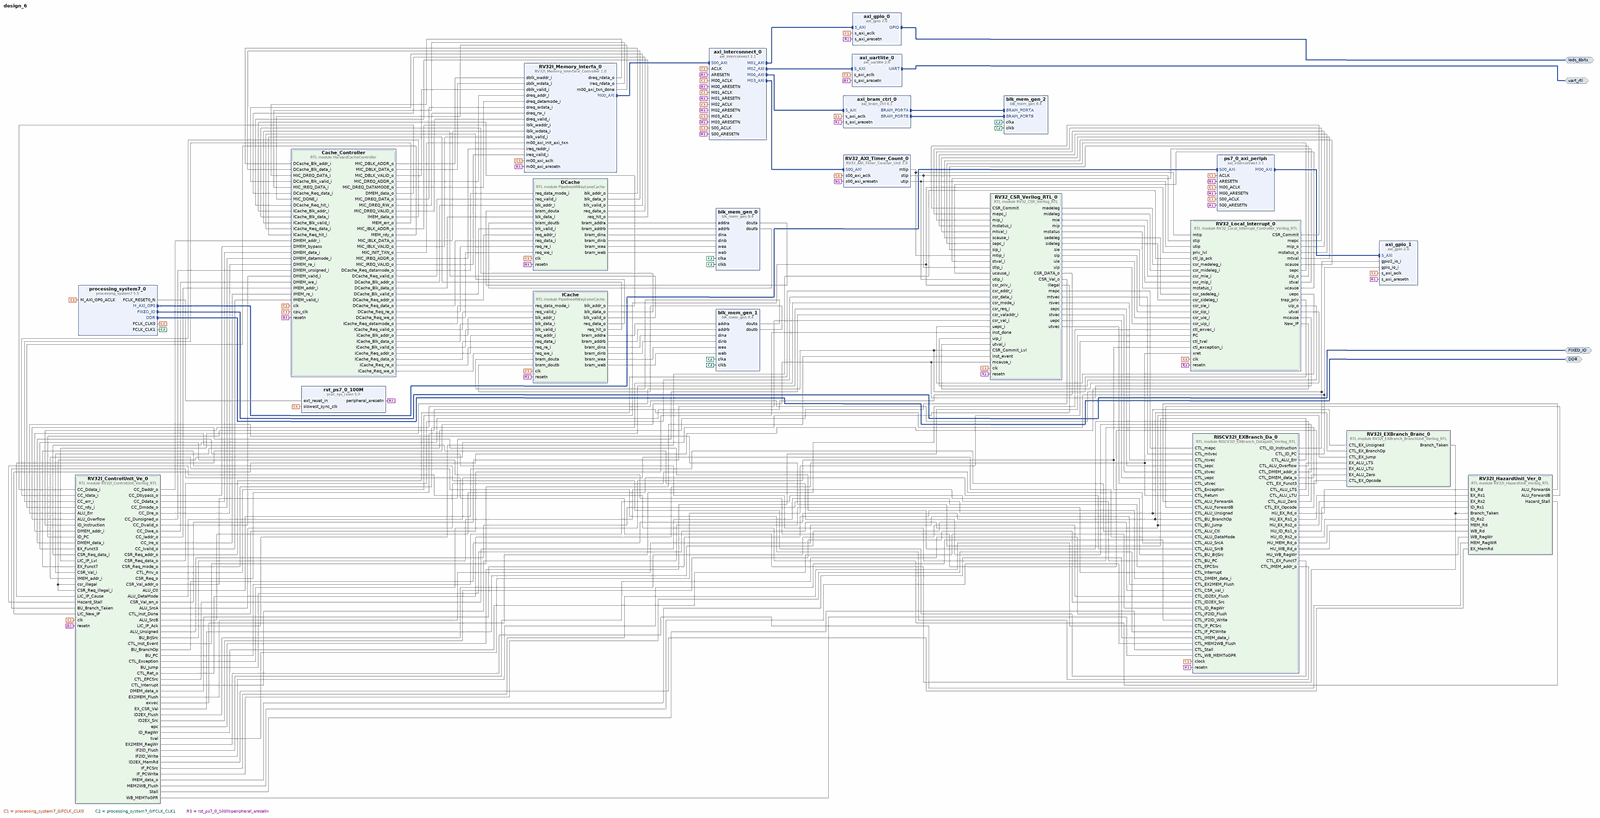
[diagram p0: block diagram of the top level, whole]
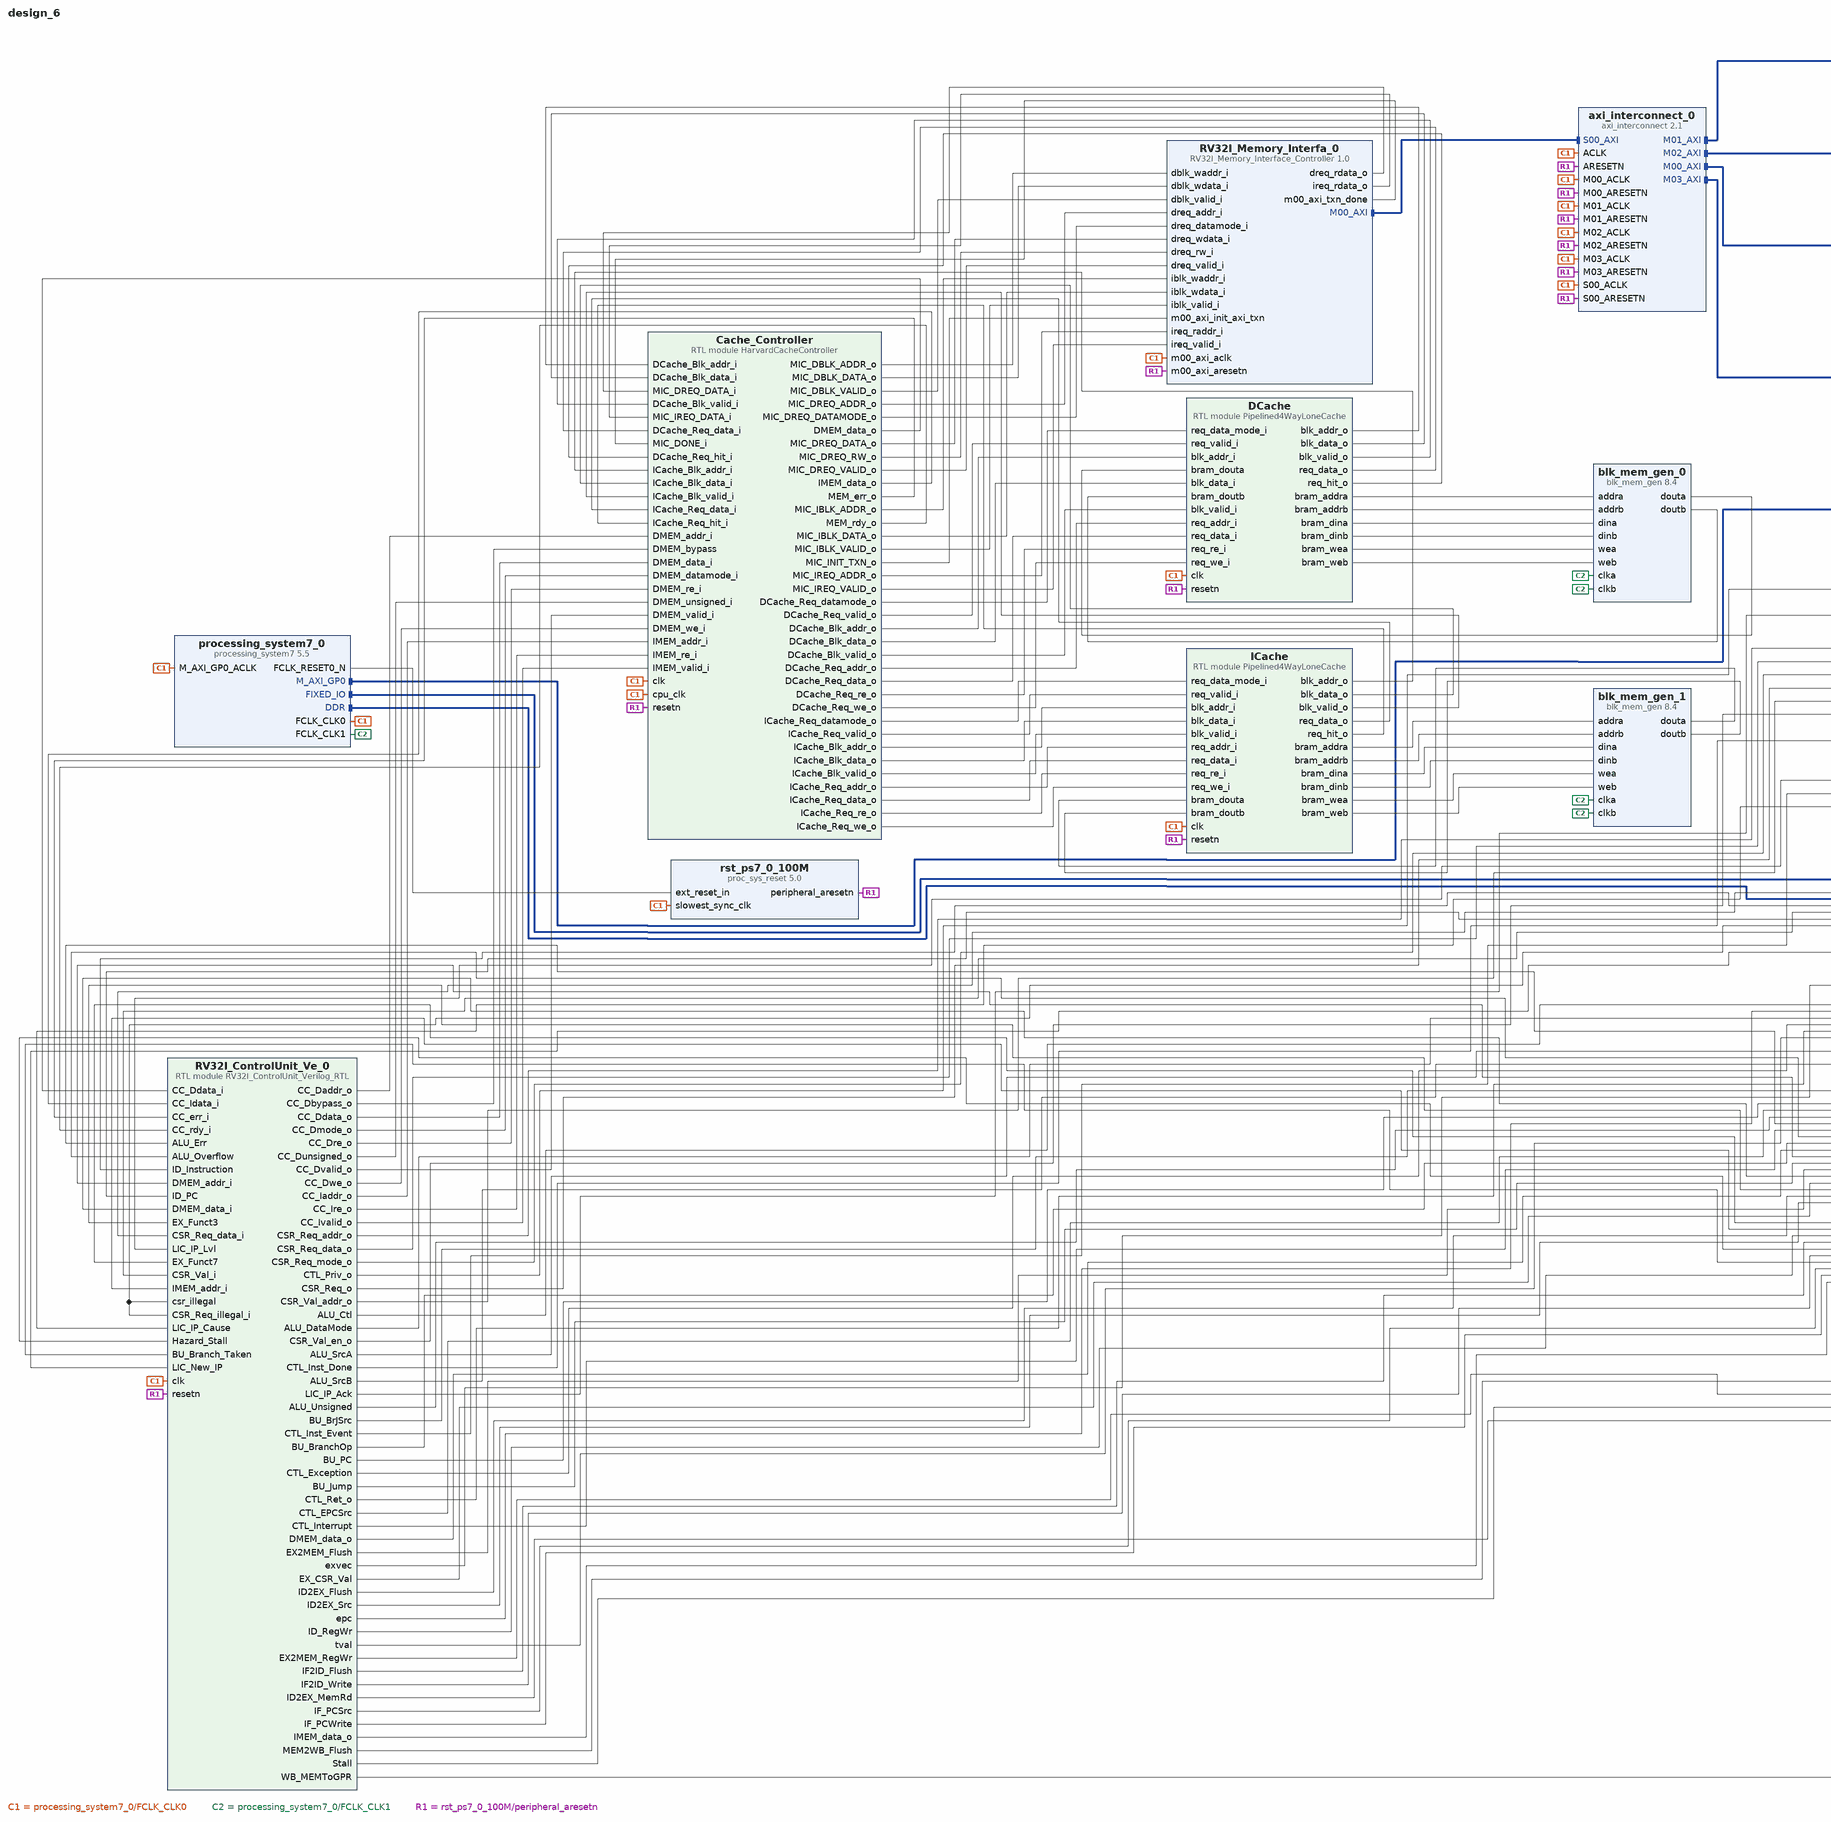
[diagram p1: block diagram of the top level, left part]
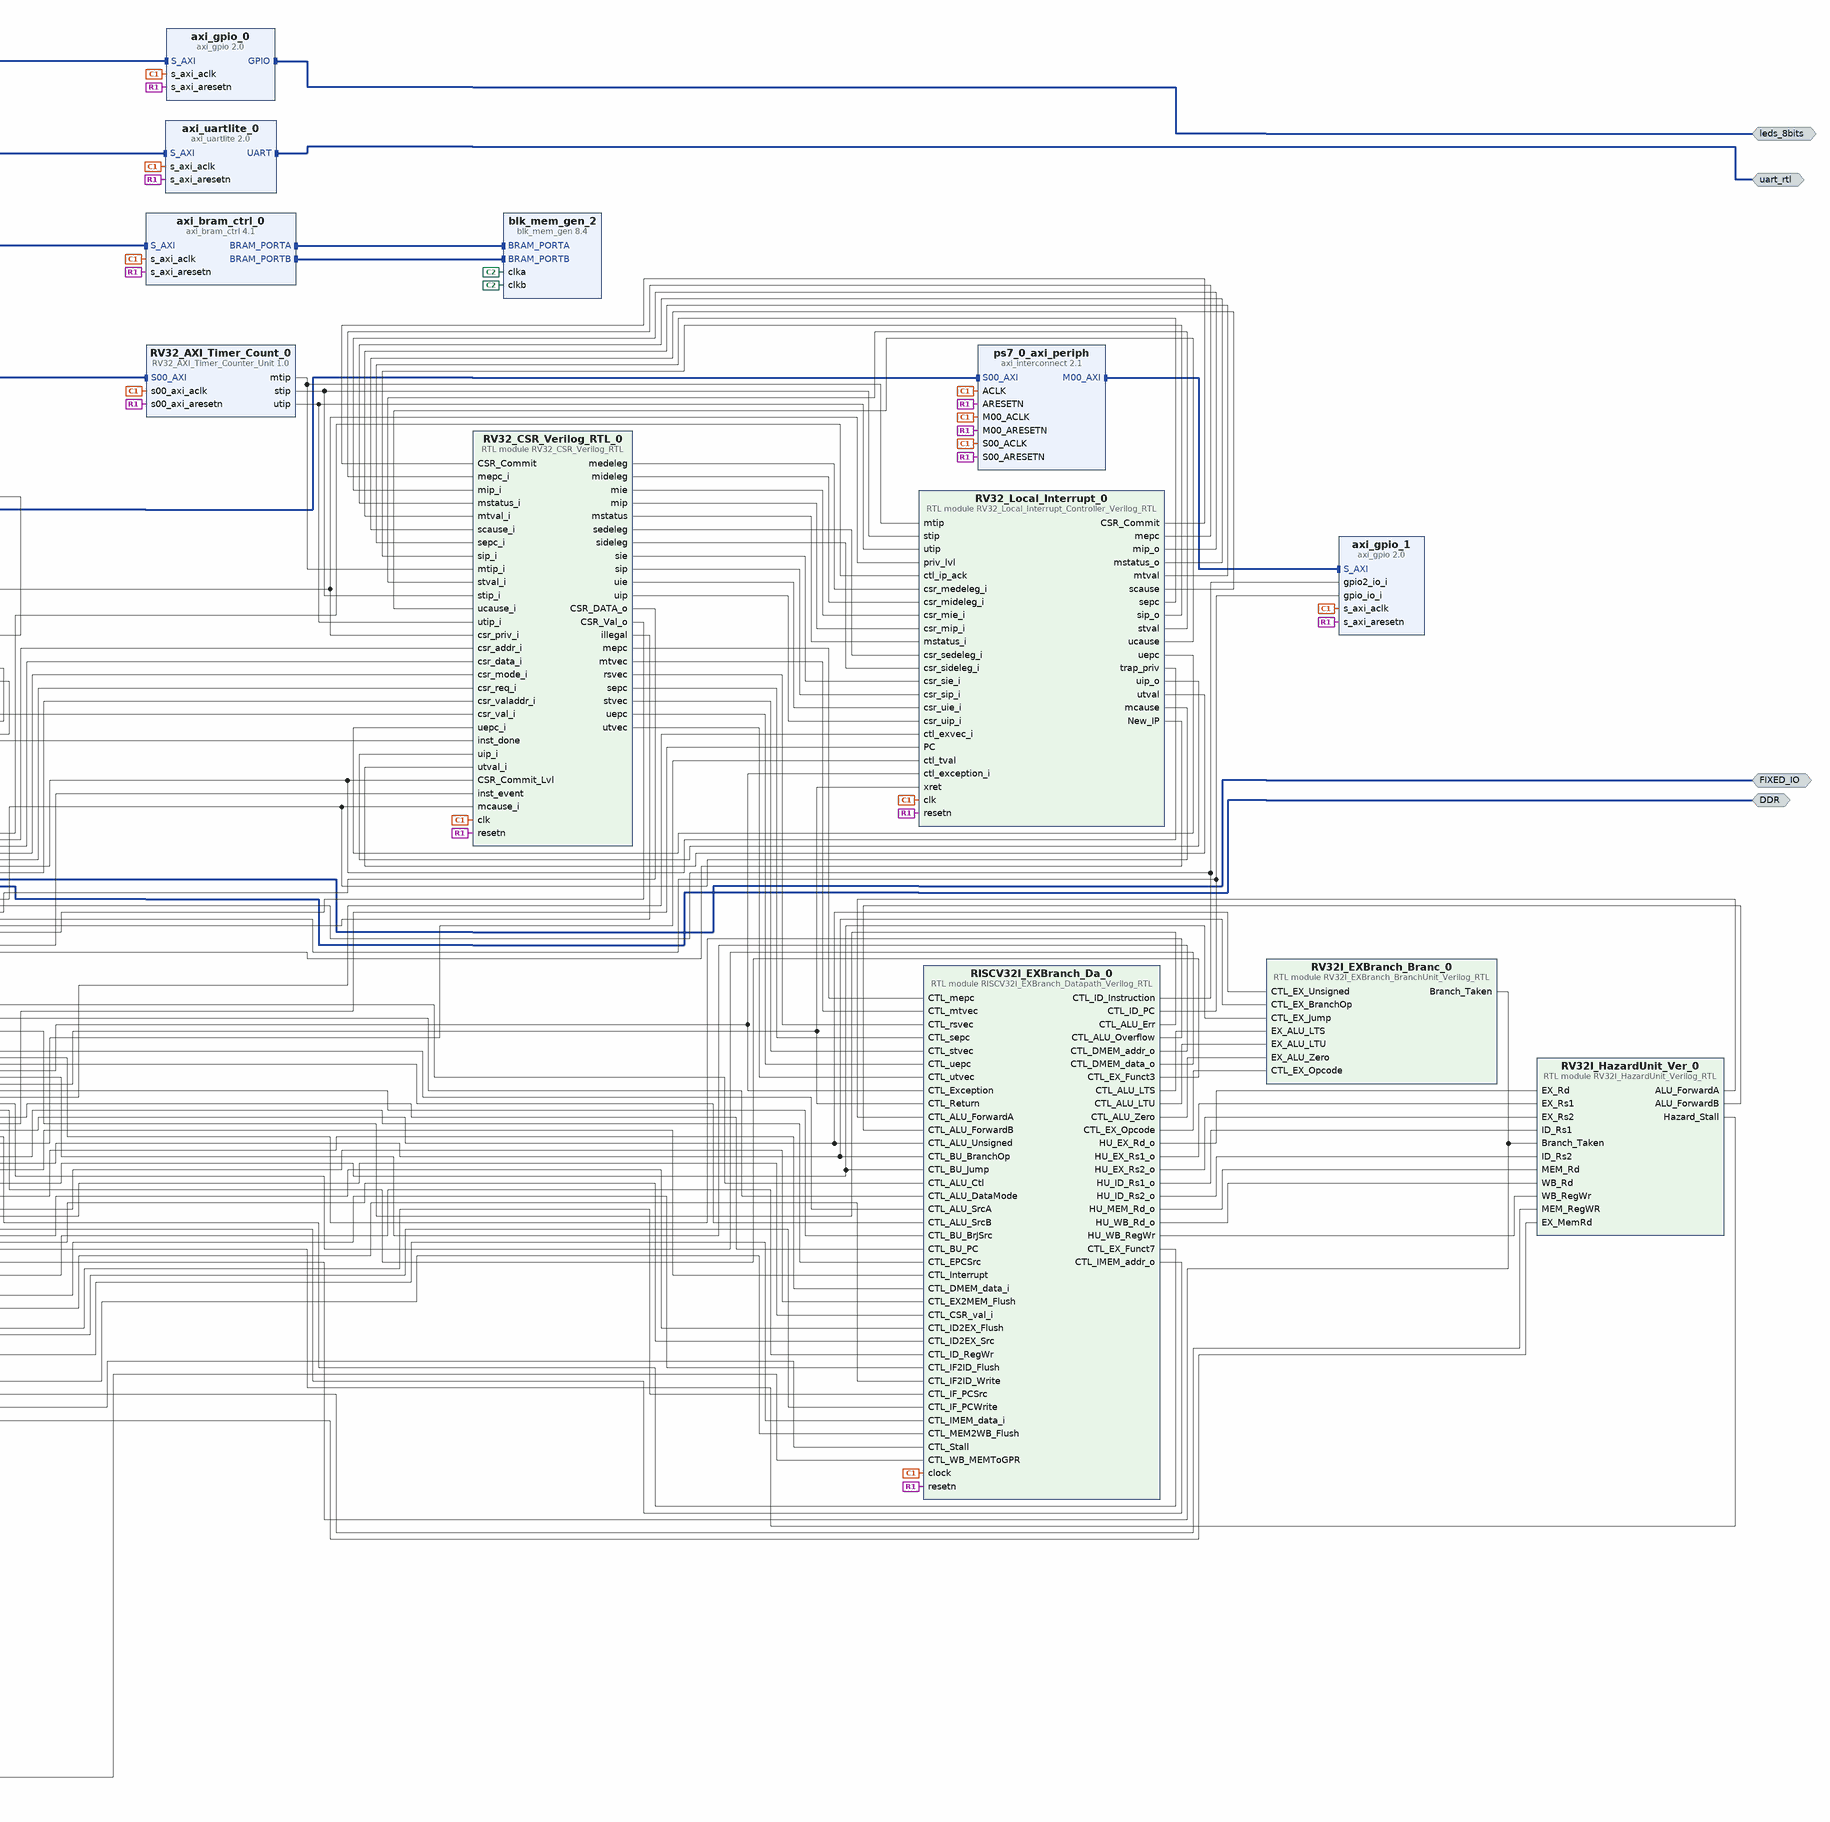
[diagram p2: block diagram of the top level, right part]
# Vivado block design design_6, xc7z020clg484-1, Vivado 2019.2
create_bd_design design_6

create_bd_intf_port -mode Master -vlnv xilinx.com:interface:ddrx_rtl:1.0 DDR
create_bd_intf_port -mode Master -vlnv xilinx.com:display_processing_system7:fixedio_rtl:1.0 FIXED_IO
create_bd_intf_port -mode Master -vlnv xilinx.com:interface:gpio_rtl:1.0 leds_8bits
create_bd_intf_port -mode Master -vlnv xilinx.com:interface:uart_rtl:1.0 uart_rtl

create_bd_cell -type module -reference RISCV32I_EXBranch_Datapath_Verilog_RTL RISCV32I_EXBranch_Da_0
create_bd_cell -type module -reference RV32I_ControlUnit_Verilog_RTL RV32I_ControlUnit_Ve_0
create_bd_cell -type module -reference RV32I_EXBranch_BranchUnit_Verilog_RTL RV32I_EXBranch_Branc_0
create_bd_cell -type module -reference RV32I_HazardUnit_Verilog_RTL RV32I_HazardUnit_Ver_0
create_bd_cell -type ip -vlnv xilinx.com:user:RV32_AXI_Timer_Counter_Unit:1.0 RV32_AXI_Timer_Count_0
create_bd_cell -type module -reference RV32_CSR_Verilog_RTL RV32_CSR_Verilog_RTL_0
create_bd_cell -type module -reference RV32_Local_Interrupt_Controller_Verilog_RTL RV32_Local_Interrupt_0
create_bd_cell -type ip -vlnv xilinx.com:ip:axi_bram_ctrl:4.1 axi_bram_ctrl_0
set_property -dict {CONFIG.DATA_WIDTH 128 CONFIG.PROTOCOL AXI4} [get_bd_cells axi_bram_ctrl_0]
create_bd_cell -type ip -vlnv xilinx.com:ip:axi_gpio:2.0 axi_gpio_0
set_property -dict {CONFIG.GPIO_BOARD_INTERFACE leds_8bits CONFIG.USE_BOARD_FLOW true} [get_bd_cells axi_gpio_0]
create_bd_cell -type ip -vlnv xilinx.com:ip:axi_gpio:2.0 axi_gpio_1
set_property -dict [list \
  CONFIG.C_ALL_INPUTS 1 \
  CONFIG.C_ALL_INPUTS_2 1 \
  CONFIG.C_IS_DUAL 1 \
  CONFIG.GPIO2_BOARD_INTERFACE Custom \
  CONFIG.GPIO_BOARD_INTERFACE Custom \
  CONFIG.USE_BOARD_FLOW true \
] [get_bd_cells axi_gpio_1]
create_bd_cell -type ip -vlnv xilinx.com:ip:axi_interconnect:2.1 axi_interconnect_0
set_property -dict {CONFIG.ENABLE_ADVANCED_OPTIONS 0 CONFIG.NUM_MI 4} [get_bd_cells axi_interconnect_0]
create_bd_cell -type ip -vlnv xilinx.com:ip:axi_uartlite:2.0 axi_uartlite_0
set_property -dict {CONFIG.C_BAUDRATE 110} [get_bd_cells axi_uartlite_0]
create_bd_cell -type ip -vlnv xilinx.com:ip:blk_mem_gen:8.4 blk_mem_gen_0
set_property -dict [list \
  CONFIG.Assume_Synchronous_Clk false \
  CONFIG.Byte_Size 8 \
  CONFIG.Enable_32bit_Address false \
  CONFIG.Enable_A Always_Enabled \
  CONFIG.Enable_B Always_Enabled \
  CONFIG.Memory_Type True_Dual_Port_RAM \
  CONFIG.Operating_Mode_A WRITE_FIRST \
  CONFIG.Operating_Mode_B WRITE_FIRST \
  CONFIG.Port_B_Clock 100 \
  CONFIG.Port_B_Enable_Rate 100 \
  CONFIG.Port_B_Write_Rate 50 \
  CONFIG.Read_Width_A 128 \
  CONFIG.Read_Width_B 128 \
  CONFIG.Register_PortA_Output_of_Memory_Primitives true \
  CONFIG.Register_PortB_Output_of_Memory_Primitives true \
  CONFIG.Use_Byte_Write_Enable true \
  CONFIG.Use_RSTA_Pin false \
  CONFIG.Use_RSTB_Pin false \
  CONFIG.Write_Depth_A 256 \
  CONFIG.Write_Width_A 128 \
  CONFIG.Write_Width_B 128 \
  CONFIG.use_bram_block Stand_Alone \
] [get_bd_cells blk_mem_gen_0]
create_bd_cell -type ip -vlnv xilinx.com:ip:blk_mem_gen:8.4 blk_mem_gen_1
set_property -dict [list \
  CONFIG.Assume_Synchronous_Clk true \
  CONFIG.Byte_Size 8 \
  CONFIG.Enable_32bit_Address false \
  CONFIG.Enable_A Always_Enabled \
  CONFIG.Enable_B Always_Enabled \
  CONFIG.Memory_Type True_Dual_Port_RAM \
  CONFIG.Operating_Mode_A WRITE_FIRST \
  CONFIG.Operating_Mode_B WRITE_FIRST \
  CONFIG.Port_B_Clock 100 \
  CONFIG.Port_B_Enable_Rate 100 \
  CONFIG.Port_B_Write_Rate 50 \
  CONFIG.Read_Width_A 128 \
  CONFIG.Read_Width_B 128 \
  CONFIG.Register_PortA_Output_of_Memory_Primitives true \
  CONFIG.Register_PortB_Output_of_Memory_Primitives true \
  CONFIG.Use_Byte_Write_Enable true \
  CONFIG.Use_RSTA_Pin false \
  CONFIG.Write_Depth_A 256 \
  CONFIG.Write_Width_A 128 \
  CONFIG.Write_Width_B 128 \
  CONFIG.use_bram_block Stand_Alone \
] [get_bd_cells blk_mem_gen_1]
create_bd_cell -type ip -vlnv xilinx.com:ip:blk_mem_gen:8.4 blk_mem_gen_2
set_property -dict [list \
  CONFIG.Coe_File ../../../../new/RISCV_Inst.coe \
  CONFIG.EN_SAFETY_CKT true \
  CONFIG.Enable_32bit_Address true \
  CONFIG.Enable_B Use_ENB_Pin \
  CONFIG.Fill_Remaining_Memory_Locations false \
  CONFIG.Load_Init_File true \
  CONFIG.Memory_Type True_Dual_Port_RAM \
  CONFIG.Port_B_Clock 100 \
  CONFIG.Port_B_Enable_Rate 100 \
  CONFIG.Port_B_Write_Rate 50 \
  CONFIG.Read_Width_A 128 \
  CONFIG.Read_Width_B 128 \
  CONFIG.Register_PortA_Output_of_Memory_Primitives true \
  CONFIG.Register_PortB_Output_of_Memory_Primitives true \
  CONFIG.Use_RSTA_Pin true \
  CONFIG.Use_RSTB_Pin true \
  CONFIG.Write_Depth_A 4096 \
  CONFIG.Write_Width_A 128 \
  CONFIG.Write_Width_B 128 \
  CONFIG.use_bram_block Stand_Alone \
] [get_bd_cells blk_mem_gen_2]
create_bd_cell -type ip -vlnv xilinx.com:ip:processing_system7:5.5 processing_system7_0
set_property -dict [list \
  CONFIG.PCW_APU_PERIPHERAL_FREQMHZ 666.666667 \
  CONFIG.PCW_ENET0_PERIPHERAL_ENABLE 0 \
  CONFIG.PCW_EN_CLK1_PORT 1 \
  CONFIG.PCW_EN_CLK2_PORT 1 \
  CONFIG.PCW_FCLK_CLK1_BUF TRUE \
  CONFIG.PCW_FPGA0_PERIPHERAL_FREQMHZ 25 \
  CONFIG.PCW_FPGA1_PERIPHERAL_FREQMHZ 50 \
  CONFIG.PCW_FPGA2_PERIPHERAL_FREQMHZ 100 \
  CONFIG.PCW_FPGA_FCLK1_ENABLE 1 \
  CONFIG.PCW_FPGA_FCLK2_ENABLE 1 \
  CONFIG.PCW_GPIO_MIO_GPIO_ENABLE 1 \
  CONFIG.PCW_GPIO_MIO_GPIO_IO MIO \
  CONFIG.PCW_I2C_RESET_ENABLE 1 \
  CONFIG.PCW_PERIPHERAL_BOARD_PRESET part0 \
  CONFIG.PCW_PRESET_BANK1_VOLTAGE {LVCMOS 1.8V} \
  CONFIG.PCW_QSPI_GRP_SINGLE_SS_ENABLE 1 \
  CONFIG.PCW_QSPI_GRP_SINGLE_SS_IO {MIO 1 .. 6} \
  CONFIG.PCW_QSPI_PERIPHERAL_ENABLE 1 \
  CONFIG.PCW_QSPI_QSPI_IO {MIO 1 .. 6} \
  CONFIG.PCW_SD0_GRP_CD_ENABLE 1 \
  CONFIG.PCW_SD0_GRP_CD_IO {MIO 47} \
  CONFIG.PCW_SD0_GRP_WP_ENABLE 1 \
  CONFIG.PCW_SD0_GRP_WP_IO {MIO 46} \
  CONFIG.PCW_SD0_PERIPHERAL_ENABLE 1 \
  CONFIG.PCW_SD0_SD0_IO {MIO 40 .. 45} \
  CONFIG.PCW_SDIO_PERIPHERAL_FREQMHZ 50 \
  CONFIG.PCW_SINGLE_QSPI_DATA_MODE x4 \
  CONFIG.PCW_TTC0_PERIPHERAL_ENABLE 1 \
  CONFIG.PCW_TTC0_TTC0_IO EMIO \
  CONFIG.PCW_UART1_PERIPHERAL_ENABLE 1 \
  CONFIG.PCW_UART1_UART1_IO {MIO 48 .. 49} \
  CONFIG.PCW_UART_PERIPHERAL_FREQMHZ 50 \
  CONFIG.PCW_UIPARAM_DDR_FREQ_MHZ 533.333313 \
  CONFIG.PCW_UIPARAM_DDR_PARTNO {MT41J128M16 HA-15E} \
  CONFIG.PCW_USB0_PERIPHERAL_ENABLE 1 \
  CONFIG.PCW_USB0_RESET_ENABLE 0 \
  CONFIG.PCW_USB0_USB0_IO {MIO 28 .. 39} \
  CONFIG.PCW_USB_RESET_ENABLE 1 \
  CONFIG.PCW_USB_RESET_SELECT {Share reset pin} \
  CONFIG.preset ZedBoard \
] [get_bd_cells processing_system7_0]
# 497 more settings of processing_system7_0 are not shown: defaults, MIO pin electricals, DDR timing, and values the tool derives
create_bd_cell -type ip -vlnv xilinx.com:ip:axi_interconnect:2.1 ps7_0_axi_periph
set_property -dict {CONFIG.NUM_MI 1} [get_bd_cells ps7_0_axi_periph]
create_bd_cell -type ip -vlnv xilinx.com:ip:proc_sys_reset:5.0 rst_ps7_0_100M
create_bd_cell -type module -reference Pipelined4WayLoneCache DCache
create_bd_cell -type module -reference Pipelined4WayLoneCache ICache
create_bd_cell -type ip -vlnv xilinx.com:user:RV32I_Memory_Interface_Controller:1.0 RV32I_Memory_Interfa_0
set_property -dict [list \
  CONFIG.C_M00_AXI_BURST_LEN 4 \
  CONFIG.C_M00_AXI_TARGET_SLAVE_BASE_ADDR 0x00000000 \
] [get_bd_cells RV32I_Memory_Interfa_0]
create_bd_cell -type module -reference HarvardCacheController Cache_Controller

# ---- connections ----

connect_bd_intf_net [get_bd_intf_pins axi_uartlite_0/S_AXI] [get_bd_intf_pins axi_interconnect_0/M02_AXI]
connect_bd_intf_net [get_bd_intf_pins ps7_0_axi_periph/M00_AXI] [get_bd_intf_pins axi_gpio_1/S_AXI]
connect_bd_intf_net [get_bd_intf_pins blk_mem_gen_2/BRAM_PORTA] [get_bd_intf_pins axi_bram_ctrl_0/BRAM_PORTA]
connect_bd_intf_net [get_bd_intf_pins axi_gpio_0/S_AXI] [get_bd_intf_pins axi_interconnect_0/M01_AXI]
connect_bd_intf_net [get_bd_intf_pins RV32_AXI_Timer_Count_0/S00_AXI] [get_bd_intf_pins axi_interconnect_0/M03_AXI]
connect_bd_intf_net [get_bd_intf_ports FIXED_IO] [get_bd_intf_pins processing_system7_0/FIXED_IO]
connect_bd_intf_net [get_bd_intf_pins axi_interconnect_0/M00_AXI] [get_bd_intf_pins axi_bram_ctrl_0/S_AXI]
connect_bd_intf_net [get_bd_intf_pins axi_interconnect_0/S00_AXI] [get_bd_intf_pins RV32I_Memory_Interfa_0/M00_AXI]
connect_bd_intf_net [get_bd_intf_pins blk_mem_gen_2/BRAM_PORTB] [get_bd_intf_pins axi_bram_ctrl_0/BRAM_PORTB]
connect_bd_intf_net [get_bd_intf_ports leds_8bits] [get_bd_intf_pins axi_gpio_0/GPIO]
connect_bd_intf_net [get_bd_intf_pins processing_system7_0/M_AXI_GP0] [get_bd_intf_pins ps7_0_axi_periph/S00_AXI]
connect_bd_intf_net [get_bd_intf_ports DDR] [get_bd_intf_pins processing_system7_0/DDR]
connect_bd_intf_net [get_bd_intf_ports uart_rtl] [get_bd_intf_pins axi_uartlite_0/UART]
connect_bd_net [get_bd_pins Cache_Controller/DCache_Req_datamode_o] [get_bd_pins DCache/req_data_mode_i]
connect_bd_net [get_bd_pins Cache_Controller/DCache_Req_valid_o] [get_bd_pins DCache/req_valid_i]
connect_bd_net [get_bd_pins Cache_Controller/DMEM_data_o] [get_bd_pins RV32I_ControlUnit_Ve_0/CC_Ddata_i]
connect_bd_net [get_bd_pins Cache_Controller/ICache_Req_datamode_o] [get_bd_pins ICache/req_data_mode_i]
connect_bd_net [get_bd_pins Cache_Controller/ICache_Req_valid_o] [get_bd_pins ICache/req_valid_i]
connect_bd_net [get_bd_pins Cache_Controller/IMEM_data_o] [get_bd_pins RV32I_ControlUnit_Ve_0/CC_Idata_i]
connect_bd_net [get_bd_pins Cache_Controller/MEM_err_o] [get_bd_pins RV32I_ControlUnit_Ve_0/CC_err_i]
connect_bd_net [get_bd_pins Cache_Controller/MEM_rdy_o] [get_bd_pins RV32I_ControlUnit_Ve_0/CC_rdy_i]
connect_bd_net [get_bd_pins Cache_Controller/MIC_DBLK_ADDR_o] [get_bd_pins RV32I_Memory_Interfa_0/dblk_waddr_i]
connect_bd_net [get_bd_pins Cache_Controller/MIC_DBLK_DATA_o] [get_bd_pins RV32I_Memory_Interfa_0/dblk_wdata_i]
connect_bd_net [get_bd_pins Cache_Controller/MIC_DBLK_VALID_o] [get_bd_pins RV32I_Memory_Interfa_0/dblk_valid_i]
connect_bd_net [get_bd_pins Cache_Controller/MIC_DREQ_ADDR_o] [get_bd_pins RV32I_Memory_Interfa_0/dreq_addr_i]
connect_bd_net [get_bd_pins Cache_Controller/MIC_DREQ_DATAMODE_o] [get_bd_pins RV32I_Memory_Interfa_0/dreq_datamode_i]
connect_bd_net [get_bd_pins Cache_Controller/MIC_DREQ_DATA_o] [get_bd_pins RV32I_Memory_Interfa_0/dreq_wdata_i]
connect_bd_net [get_bd_pins Cache_Controller/MIC_DREQ_RW_o] [get_bd_pins RV32I_Memory_Interfa_0/dreq_rw_i]
connect_bd_net [get_bd_pins Cache_Controller/MIC_DREQ_VALID_o] [get_bd_pins RV32I_Memory_Interfa_0/dreq_valid_i]
connect_bd_net [get_bd_pins Cache_Controller/MIC_IBLK_ADDR_o] [get_bd_pins RV32I_Memory_Interfa_0/iblk_waddr_i]
connect_bd_net [get_bd_pins Cache_Controller/MIC_IBLK_DATA_o] [get_bd_pins RV32I_Memory_Interfa_0/iblk_wdata_i]
connect_bd_net [get_bd_pins Cache_Controller/MIC_IBLK_VALID_o] [get_bd_pins RV32I_Memory_Interfa_0/iblk_valid_i]
connect_bd_net [get_bd_pins Cache_Controller/MIC_INIT_TXN_o] [get_bd_pins RV32I_Memory_Interfa_0/m00_axi_init_axi_txn]
connect_bd_net [get_bd_pins Cache_Controller/MIC_IREQ_ADDR_o] [get_bd_pins RV32I_Memory_Interfa_0/ireq_raddr_i]
connect_bd_net [get_bd_pins Cache_Controller/MIC_IREQ_VALID_o] [get_bd_pins RV32I_Memory_Interfa_0/ireq_valid_i]
connect_bd_net [get_bd_pins DCache/blk_addr_o] [get_bd_pins Cache_Controller/DCache_Blk_addr_i]
connect_bd_net [get_bd_pins DCache/blk_data_o] [get_bd_pins Cache_Controller/DCache_Blk_data_i]
connect_bd_net [get_bd_pins DCache/blk_valid_o] [get_bd_pins Cache_Controller/DCache_Blk_valid_i]
connect_bd_net [get_bd_pins DCache/bram_addra] [get_bd_pins blk_mem_gen_0/addra]
connect_bd_net [get_bd_pins DCache/bram_addrb] [get_bd_pins blk_mem_gen_0/addrb]
connect_bd_net [get_bd_pins DCache/bram_dina] [get_bd_pins blk_mem_gen_0/dina]
connect_bd_net [get_bd_pins DCache/bram_dinb] [get_bd_pins blk_mem_gen_0/dinb]
connect_bd_net [get_bd_pins DCache/bram_wea] [get_bd_pins blk_mem_gen_0/wea]
connect_bd_net [get_bd_pins DCache/bram_web] [get_bd_pins blk_mem_gen_0/web]
connect_bd_net [get_bd_pins DCache/req_data_o] [get_bd_pins Cache_Controller/DCache_Req_data_i]
connect_bd_net [get_bd_pins DCache/req_hit_o] [get_bd_pins Cache_Controller/DCache_Req_hit_i]
connect_bd_net -net HarvardCacheControll_0_DCache_Blk_addr_o [get_bd_pins Cache_Controller/DCache_Blk_addr_o] [get_bd_pins DCache/blk_addr_i]
connect_bd_net -net HarvardCacheControll_0_DCache_Blk_data_o [get_bd_pins Cache_Controller/DCache_Blk_data_o] [get_bd_pins DCache/blk_data_i]
connect_bd_net -net HarvardCacheControll_0_DCache_Blk_valid_o [get_bd_pins Cache_Controller/DCache_Blk_valid_o] [get_bd_pins DCache/blk_valid_i]
connect_bd_net -net HarvardCacheControll_0_DCache_Req_addr_o [get_bd_pins Cache_Controller/DCache_Req_addr_o] [get_bd_pins DCache/req_addr_i]
connect_bd_net -net HarvardCacheControll_0_DCache_Req_data_o [get_bd_pins Cache_Controller/DCache_Req_data_o] [get_bd_pins DCache/req_data_i]
connect_bd_net -net HarvardCacheControll_0_DCache_Req_re_o [get_bd_pins Cache_Controller/DCache_Req_re_o] [get_bd_pins DCache/req_re_i]
connect_bd_net -net HarvardCacheControll_0_DCache_Req_we_o [get_bd_pins Cache_Controller/DCache_Req_we_o] [get_bd_pins DCache/req_we_i]
connect_bd_net -net HarvardCacheControll_0_ICache_Blk_addr_o [get_bd_pins Cache_Controller/ICache_Blk_addr_o] [get_bd_pins ICache/blk_addr_i]
connect_bd_net -net HarvardCacheControll_0_ICache_Blk_data_o [get_bd_pins Cache_Controller/ICache_Blk_data_o] [get_bd_pins ICache/blk_data_i]
connect_bd_net -net HarvardCacheControll_0_ICache_Blk_valid_o [get_bd_pins Cache_Controller/ICache_Blk_valid_o] [get_bd_pins ICache/blk_valid_i]
connect_bd_net -net HarvardCacheControll_0_ICache_Req_addr_o [get_bd_pins Cache_Controller/ICache_Req_addr_o] [get_bd_pins ICache/req_addr_i]
connect_bd_net -net HarvardCacheControll_0_ICache_Req_data_o [get_bd_pins Cache_Controller/ICache_Req_data_o] [get_bd_pins ICache/req_data_i]
connect_bd_net -net HarvardCacheControll_0_ICache_Req_re_o [get_bd_pins Cache_Controller/ICache_Req_re_o] [get_bd_pins ICache/req_re_i]
connect_bd_net -net HarvardCacheControll_0_ICache_Req_we_o [get_bd_pins Cache_Controller/ICache_Req_we_o] [get_bd_pins ICache/req_we_i]
connect_bd_net [get_bd_pins ICache/blk_addr_o] [get_bd_pins Cache_Controller/ICache_Blk_addr_i]
connect_bd_net [get_bd_pins ICache/blk_data_o] [get_bd_pins Cache_Controller/ICache_Blk_data_i]
connect_bd_net [get_bd_pins ICache/blk_valid_o] [get_bd_pins Cache_Controller/ICache_Blk_valid_i]
connect_bd_net [get_bd_pins ICache/bram_addra] [get_bd_pins blk_mem_gen_1/addra]
connect_bd_net [get_bd_pins ICache/bram_addrb] [get_bd_pins blk_mem_gen_1/addrb]
connect_bd_net [get_bd_pins ICache/bram_dina] [get_bd_pins blk_mem_gen_1/dina]
connect_bd_net [get_bd_pins ICache/bram_dinb] [get_bd_pins blk_mem_gen_1/dinb]
connect_bd_net [get_bd_pins ICache/bram_wea] [get_bd_pins blk_mem_gen_1/wea]
connect_bd_net [get_bd_pins ICache/bram_web] [get_bd_pins blk_mem_gen_1/web]
connect_bd_net [get_bd_pins ICache/req_data_o] [get_bd_pins Cache_Controller/ICache_Req_data_i]
connect_bd_net [get_bd_pins ICache/req_hit_o] [get_bd_pins Cache_Controller/ICache_Req_hit_i]
connect_bd_net [get_bd_pins RISCV32I_EXBranch_Da_0/CTL_ALU_Err] [get_bd_pins RV32I_ControlUnit_Ve_0/ALU_Err]
connect_bd_net [get_bd_pins RISCV32I_EXBranch_Da_0/CTL_ALU_LTS] [get_bd_pins RV32I_EXBranch_Branc_0/EX_ALU_LTS]
connect_bd_net [get_bd_pins RISCV32I_EXBranch_Da_0/CTL_ALU_LTU] [get_bd_pins RV32I_EXBranch_Branc_0/EX_ALU_LTU]
connect_bd_net [get_bd_pins RISCV32I_EXBranch_Da_0/CTL_ALU_Overflow] [get_bd_pins RV32I_ControlUnit_Ve_0/ALU_Overflow]
connect_bd_net [get_bd_pins RISCV32I_EXBranch_Da_0/CTL_ALU_Zero] [get_bd_pins RV32I_EXBranch_Branc_0/EX_ALU_Zero]
connect_bd_net [get_bd_pins RISCV32I_EXBranch_Da_0/CTL_DMEM_addr_o] [get_bd_pins RV32I_ControlUnit_Ve_0/DMEM_addr_i]
connect_bd_net [get_bd_pins RISCV32I_EXBranch_Da_0/CTL_DMEM_data_o] [get_bd_pins RV32I_ControlUnit_Ve_0/DMEM_data_i]
connect_bd_net [get_bd_pins RISCV32I_EXBranch_Da_0/CTL_EX_Funct3] [get_bd_pins RV32I_ControlUnit_Ve_0/EX_Funct3]
connect_bd_net [get_bd_pins RISCV32I_EXBranch_Da_0/CTL_EX_Funct7] [get_bd_pins RV32I_ControlUnit_Ve_0/EX_Funct7]
connect_bd_net [get_bd_pins RISCV32I_EXBranch_Da_0/CTL_EX_Opcode] [get_bd_pins RV32I_EXBranch_Branc_0/CTL_EX_Opcode]
connect_bd_net [get_bd_pins RISCV32I_EXBranch_Da_0/CTL_ID_Instruction] \
  [get_bd_pins RV32I_ControlUnit_Ve_0/ID_Instruction] [get_bd_pins axi_gpio_1/gpio2_io_i]
connect_bd_net [get_bd_pins RISCV32I_EXBranch_Da_0/CTL_ID_PC] [get_bd_pins RV32I_ControlUnit_Ve_0/ID_PC] [get_bd_pins axi_gpio_1/gpio_io_i]
connect_bd_net [get_bd_pins RISCV32I_EXBranch_Da_0/CTL_IMEM_addr_o] [get_bd_pins RV32I_ControlUnit_Ve_0/IMEM_addr_i]
connect_bd_net [get_bd_pins RISCV32I_EXBranch_Da_0/HU_EX_Rd_o] [get_bd_pins RV32I_HazardUnit_Ver_0/EX_Rd]
connect_bd_net [get_bd_pins RISCV32I_EXBranch_Da_0/HU_EX_Rs1_o] [get_bd_pins RV32I_HazardUnit_Ver_0/EX_Rs1]
connect_bd_net [get_bd_pins RISCV32I_EXBranch_Da_0/HU_EX_Rs2_o] [get_bd_pins RV32I_HazardUnit_Ver_0/EX_Rs2]
connect_bd_net [get_bd_pins RISCV32I_EXBranch_Da_0/HU_ID_Rs1_o] [get_bd_pins RV32I_HazardUnit_Ver_0/ID_Rs1]
connect_bd_net [get_bd_pins RISCV32I_EXBranch_Da_0/HU_ID_Rs2_o] [get_bd_pins RV32I_HazardUnit_Ver_0/ID_Rs2]
connect_bd_net [get_bd_pins RISCV32I_EXBranch_Da_0/HU_MEM_Rd_o] [get_bd_pins RV32I_HazardUnit_Ver_0/MEM_Rd]
connect_bd_net [get_bd_pins RV32I_ControlUnit_Ve_0/ALU_Ctl] [get_bd_pins RISCV32I_EXBranch_Da_0/CTL_ALU_Ctl]
connect_bd_net [get_bd_pins RV32I_ControlUnit_Ve_0/ALU_DataMode] [get_bd_pins RISCV32I_EXBranch_Da_0/CTL_ALU_DataMode]
connect_bd_net [get_bd_pins RV32I_ControlUnit_Ve_0/ALU_SrcA] [get_bd_pins RISCV32I_EXBranch_Da_0/CTL_ALU_SrcA]
connect_bd_net [get_bd_pins RV32I_ControlUnit_Ve_0/ALU_SrcB] [get_bd_pins RISCV32I_EXBranch_Da_0/CTL_ALU_SrcB]
connect_bd_net [get_bd_pins RV32I_ControlUnit_Ve_0/ALU_Unsigned] \
  [get_bd_pins RV32I_EXBranch_Branc_0/CTL_EX_Unsigned] [get_bd_pins RISCV32I_EXBranch_Da_0/CTL_ALU_Unsigned]
connect_bd_net [get_bd_pins RV32I_ControlUnit_Ve_0/BU_BrJSrc] [get_bd_pins RISCV32I_EXBranch_Da_0/CTL_BU_BrJSrc]
connect_bd_net [get_bd_pins RV32I_ControlUnit_Ve_0/BU_BranchOp] \
  [get_bd_pins RV32I_EXBranch_Branc_0/CTL_EX_BranchOp] [get_bd_pins RISCV32I_EXBranch_Da_0/CTL_BU_BranchOp]
connect_bd_net [get_bd_pins RV32I_ControlUnit_Ve_0/BU_Jump] \
  [get_bd_pins RV32I_EXBranch_Branc_0/CTL_EX_Jump] [get_bd_pins RISCV32I_EXBranch_Da_0/CTL_BU_Jump]
connect_bd_net [get_bd_pins RV32I_ControlUnit_Ve_0/BU_PC] [get_bd_pins RISCV32I_EXBranch_Da_0/CTL_BU_PC]
connect_bd_net [get_bd_pins RV32I_ControlUnit_Ve_0/CC_Daddr_o] [get_bd_pins Cache_Controller/DMEM_addr_i]
connect_bd_net [get_bd_pins RV32I_ControlUnit_Ve_0/CC_Dbypass_o] [get_bd_pins Cache_Controller/DMEM_bypass]
connect_bd_net [get_bd_pins RV32I_ControlUnit_Ve_0/CC_Ddata_o] [get_bd_pins Cache_Controller/DMEM_data_i]
connect_bd_net [get_bd_pins RV32I_ControlUnit_Ve_0/CC_Dmode_o] [get_bd_pins Cache_Controller/DMEM_datamode_i]
connect_bd_net [get_bd_pins RV32I_ControlUnit_Ve_0/CC_Dre_o] [get_bd_pins Cache_Controller/DMEM_re_i]
connect_bd_net [get_bd_pins RV32I_ControlUnit_Ve_0/CC_Dunsigned_o] [get_bd_pins Cache_Controller/DMEM_unsigned_i]
connect_bd_net [get_bd_pins RV32I_ControlUnit_Ve_0/CC_Dvalid_o] [get_bd_pins Cache_Controller/DMEM_valid_i]
connect_bd_net [get_bd_pins RV32I_ControlUnit_Ve_0/CC_Dwe_o] [get_bd_pins Cache_Controller/DMEM_we_i]
connect_bd_net [get_bd_pins RV32I_ControlUnit_Ve_0/CC_Iaddr_o] [get_bd_pins Cache_Controller/IMEM_addr_i]
connect_bd_net [get_bd_pins RV32I_ControlUnit_Ve_0/CC_Ire_o] [get_bd_pins Cache_Controller/IMEM_re_i]
connect_bd_net [get_bd_pins RV32I_ControlUnit_Ve_0/CC_Ivalid_o] [get_bd_pins Cache_Controller/IMEM_valid_i]
connect_bd_net [get_bd_pins RV32I_ControlUnit_Ve_0/CSR_Req_addr_o] [get_bd_pins RV32_CSR_Verilog_RTL_0/csr_addr_i]
connect_bd_net [get_bd_pins RV32I_ControlUnit_Ve_0/CSR_Req_data_o] [get_bd_pins RV32_CSR_Verilog_RTL_0/csr_data_i]
connect_bd_net [get_bd_pins RV32I_ControlUnit_Ve_0/CSR_Req_mode_o] [get_bd_pins RV32_CSR_Verilog_RTL_0/csr_mode_i]
connect_bd_net [get_bd_pins RV32I_ControlUnit_Ve_0/CSR_Req_o] [get_bd_pins RV32_CSR_Verilog_RTL_0/csr_req_i]
connect_bd_net [get_bd_pins RV32I_ControlUnit_Ve_0/CSR_Val_addr_o] [get_bd_pins RV32_CSR_Verilog_RTL_0/csr_valaddr_i]
connect_bd_net [get_bd_pins RV32I_ControlUnit_Ve_0/CSR_Val_en_o] [get_bd_pins RV32_CSR_Verilog_RTL_0/csr_val_i]
connect_bd_net [get_bd_pins RV32I_ControlUnit_Ve_0/CTL_EPCSrc] [get_bd_pins RISCV32I_EXBranch_Da_0/CTL_EPCSrc]
connect_bd_net [get_bd_pins RV32I_ControlUnit_Ve_0/CTL_Exception] \
  [get_bd_pins RV32_Local_Interrupt_0/ctl_exception_i] [get_bd_pins RISCV32I_EXBranch_Da_0/CTL_Exception]
connect_bd_net [get_bd_pins RV32I_ControlUnit_Ve_0/CTL_Inst_Done] [get_bd_pins RV32_CSR_Verilog_RTL_0/inst_done]
connect_bd_net [get_bd_pins RV32I_ControlUnit_Ve_0/CTL_Inst_Event] [get_bd_pins RV32_CSR_Verilog_RTL_0/inst_event]
connect_bd_net [get_bd_pins RV32I_ControlUnit_Ve_0/CTL_Interrupt] [get_bd_pins RISCV32I_EXBranch_Da_0/CTL_Interrupt]
connect_bd_net [get_bd_pins RV32I_ControlUnit_Ve_0/CTL_Priv_o] \
  [get_bd_pins RV32_Local_Interrupt_0/priv_lvl] [get_bd_pins RV32_CSR_Verilog_RTL_0/csr_priv_i]
connect_bd_net [get_bd_pins RV32I_ControlUnit_Ve_0/CTL_Ret_o] \
  [get_bd_pins RV32_Local_Interrupt_0/xret] [get_bd_pins RISCV32I_EXBranch_Da_0/CTL_Return]
connect_bd_net [get_bd_pins RV32I_ControlUnit_Ve_0/DMEM_data_o] [get_bd_pins RISCV32I_EXBranch_Da_0/CTL_DMEM_data_i]
connect_bd_net [get_bd_pins RV32I_ControlUnit_Ve_0/EX2MEM_Flush] [get_bd_pins RISCV32I_EXBranch_Da_0/CTL_EX2MEM_Flush]
connect_bd_net [get_bd_pins RV32I_ControlUnit_Ve_0/EX2MEM_RegWr] [get_bd_pins RV32I_HazardUnit_Ver_0/MEM_RegWR]
connect_bd_net [get_bd_pins RV32I_ControlUnit_Ve_0/EX_CSR_Val] [get_bd_pins RISCV32I_EXBranch_Da_0/CTL_CSR_val_i]
connect_bd_net [get_bd_pins RV32I_ControlUnit_Ve_0/ID2EX_Flush] [get_bd_pins RISCV32I_EXBranch_Da_0/CTL_ID2EX_Flush]
connect_bd_net [get_bd_pins RV32I_ControlUnit_Ve_0/ID2EX_MemRd] [get_bd_pins RV32I_HazardUnit_Ver_0/EX_MemRd]
connect_bd_net [get_bd_pins RV32I_ControlUnit_Ve_0/ID2EX_Src] [get_bd_pins RISCV32I_EXBranch_Da_0/CTL_ID2EX_Src]
connect_bd_net [get_bd_pins RV32I_ControlUnit_Ve_0/ID_RegWr] [get_bd_pins RISCV32I_EXBranch_Da_0/CTL_ID_RegWr]
connect_bd_net [get_bd_pins RV32I_ControlUnit_Ve_0/IF2ID_Flush] [get_bd_pins RISCV32I_EXBranch_Da_0/CTL_IF2ID_Flush]
connect_bd_net [get_bd_pins RV32I_ControlUnit_Ve_0/IF2ID_Write] [get_bd_pins RISCV32I_EXBranch_Da_0/CTL_IF2ID_Write]
connect_bd_net [get_bd_pins RV32I_ControlUnit_Ve_0/IF_PCSrc] [get_bd_pins RISCV32I_EXBranch_Da_0/CTL_IF_PCSrc]
connect_bd_net [get_bd_pins RV32I_ControlUnit_Ve_0/IF_PCWrite] [get_bd_pins RISCV32I_EXBranch_Da_0/CTL_IF_PCWrite]
connect_bd_net [get_bd_pins RV32I_ControlUnit_Ve_0/IMEM_data_o] [get_bd_pins RISCV32I_EXBranch_Da_0/CTL_IMEM_data_i]
connect_bd_net [get_bd_pins RV32I_ControlUnit_Ve_0/LIC_IP_Ack] [get_bd_pins RV32_Local_Interrupt_0/ctl_ip_ack]
connect_bd_net [get_bd_pins RV32I_ControlUnit_Ve_0/MEM2WB_Flush] [get_bd_pins RISCV32I_EXBranch_Da_0/CTL_MEM2WB_Flush]
connect_bd_net [get_bd_pins RV32I_ControlUnit_Ve_0/Stall] [get_bd_pins RISCV32I_EXBranch_Da_0/CTL_Stall]
connect_bd_net [get_bd_pins RV32I_ControlUnit_Ve_0/WB_MEMToGPR] [get_bd_pins RISCV32I_EXBranch_Da_0/CTL_WB_MEMToGPR]
connect_bd_net -net RV32I_ControlUnit_Ve_0_ecausevec [get_bd_pins RV32I_ControlUnit_Ve_0/exvec] [get_bd_pins RV32_Local_Interrupt_0/ctl_exvec_i]
connect_bd_net [get_bd_pins RV32I_ControlUnit_Ve_0/epc] [get_bd_pins RV32_Local_Interrupt_0/PC]
connect_bd_net [get_bd_pins RV32I_ControlUnit_Ve_0/tval] [get_bd_pins RV32_Local_Interrupt_0/ctl_tval]
connect_bd_net [get_bd_pins RV32I_HazardUnit_Ver_0/ALU_ForwardA] [get_bd_pins RISCV32I_EXBranch_Da_0/CTL_ALU_ForwardA]
connect_bd_net [get_bd_pins RV32I_HazardUnit_Ver_0/ALU_ForwardB] [get_bd_pins RISCV32I_EXBranch_Da_0/CTL_ALU_ForwardB]
connect_bd_net [get_bd_pins RV32I_HazardUnit_Ver_0/Hazard_Stall] [get_bd_pins RV32I_ControlUnit_Ve_0/Hazard_Stall]
connect_bd_net -net RV32I_IDBranch_Branc_0_Branch_Taken [get_bd_pins RV32I_EXBranch_Branc_0/Branch_Taken] \
  [get_bd_pins RV32I_HazardUnit_Ver_0/Branch_Taken] [get_bd_pins RV32I_ControlUnit_Ve_0/BU_Branch_Taken]
connect_bd_net [get_bd_pins RV32I_Memory_Interfa_0/dreq_rdata_o] [get_bd_pins Cache_Controller/MIC_DREQ_DATA_i]
connect_bd_net [get_bd_pins RV32I_Memory_Interfa_0/ireq_rdata_o] [get_bd_pins Cache_Controller/MIC_IREQ_DATA_i]
connect_bd_net [get_bd_pins RV32I_Memory_Interfa_0/m00_axi_txn_done] [get_bd_pins Cache_Controller/MIC_DONE_i]
connect_bd_net [get_bd_pins RV32_AXI_Timer_Count_0/mtip] [get_bd_pins RV32_Local_Interrupt_0/mtip] [get_bd_pins RV32_CSR_Verilog_RTL_0/mtip_i]
connect_bd_net [get_bd_pins RV32_AXI_Timer_Count_0/stip] [get_bd_pins RV32_Local_Interrupt_0/stip] [get_bd_pins RV32_CSR_Verilog_RTL_0/stip_i]
connect_bd_net [get_bd_pins RV32_AXI_Timer_Count_0/utip] [get_bd_pins RV32_Local_Interrupt_0/utip] [get_bd_pins RV32_CSR_Verilog_RTL_0/utip_i]
connect_bd_net [get_bd_pins RV32_CSR_Verilog_RTL_0/CSR_DATA_o] [get_bd_pins RV32I_ControlUnit_Ve_0/CSR_Req_data_i]
connect_bd_net [get_bd_pins RV32_CSR_Verilog_RTL_0/CSR_Val_o] [get_bd_pins RV32I_ControlUnit_Ve_0/CSR_Val_i]
connect_bd_net [get_bd_pins RV32_CSR_Verilog_RTL_0/illegal] \
  [get_bd_pins RV32I_ControlUnit_Ve_0/CSR_Req_illegal_i] [get_bd_pins RV32I_ControlUnit_Ve_0/csr_illegal]
connect_bd_net [get_bd_pins RV32_CSR_Verilog_RTL_0/medeleg] [get_bd_pins RV32_Local_Interrupt_0/csr_medeleg_i]
connect_bd_net [get_bd_pins RV32_CSR_Verilog_RTL_0/mepc] [get_bd_pins RISCV32I_EXBranch_Da_0/CTL_mepc]
connect_bd_net [get_bd_pins RV32_CSR_Verilog_RTL_0/mideleg] [get_bd_pins RV32_Local_Interrupt_0/csr_mideleg_i]
connect_bd_net [get_bd_pins RV32_CSR_Verilog_RTL_0/mie] [get_bd_pins RV32_Local_Interrupt_0/csr_mie_i]
connect_bd_net [get_bd_pins RV32_CSR_Verilog_RTL_0/mip] [get_bd_pins RV32_Local_Interrupt_0/csr_mip_i]
connect_bd_net [get_bd_pins RV32_CSR_Verilog_RTL_0/mstatus] [get_bd_pins RV32_Local_Interrupt_0/mstatus_i]
connect_bd_net [get_bd_pins RV32_CSR_Verilog_RTL_0/mtvec] [get_bd_pins RISCV32I_EXBranch_Da_0/CTL_mtvec]
connect_bd_net [get_bd_pins RV32_CSR_Verilog_RTL_0/rsvec] [get_bd_pins RISCV32I_EXBranch_Da_0/CTL_rsvec]
connect_bd_net [get_bd_pins RV32_CSR_Verilog_RTL_0/sedeleg] [get_bd_pins RV32_Local_Interrupt_0/csr_sedeleg_i]
connect_bd_net [get_bd_pins RV32_CSR_Verilog_RTL_0/sepc] [get_bd_pins RISCV32I_EXBranch_Da_0/CTL_sepc]
connect_bd_net [get_bd_pins RV32_CSR_Verilog_RTL_0/sideleg] [get_bd_pins RV32_Local_Interrupt_0/csr_sideleg_i]
connect_bd_net [get_bd_pins RV32_CSR_Verilog_RTL_0/sie] [get_bd_pins RV32_Local_Interrupt_0/csr_sie_i]
connect_bd_net [get_bd_pins RV32_CSR_Verilog_RTL_0/sip] [get_bd_pins RV32_Local_Interrupt_0/csr_sip_i]
connect_bd_net [get_bd_pins RV32_CSR_Verilog_RTL_0/stvec] [get_bd_pins RISCV32I_EXBranch_Da_0/CTL_stvec]
connect_bd_net [get_bd_pins RV32_CSR_Verilog_RTL_0/uepc] [get_bd_pins RISCV32I_EXBranch_Da_0/CTL_uepc]
connect_bd_net [get_bd_pins RV32_CSR_Verilog_RTL_0/uie] [get_bd_pins RV32_Local_Interrupt_0/csr_uie_i]
connect_bd_net [get_bd_pins RV32_CSR_Verilog_RTL_0/uip] [get_bd_pins RV32_Local_Interrupt_0/csr_uip_i]
connect_bd_net [get_bd_pins RV32_CSR_Verilog_RTL_0/utvec] [get_bd_pins RISCV32I_EXBranch_Da_0/CTL_utvec]
connect_bd_net [get_bd_pins RV32_Local_Interrupt_0/CSR_Commit] [get_bd_pins RV32_CSR_Verilog_RTL_0/CSR_Commit]
connect_bd_net -net RV32_Local_Interrupt_0_CSR_Commit_Lvl [get_bd_pins RV32_Local_Interrupt_0/trap_priv] \
  [get_bd_pins RV32_CSR_Verilog_RTL_0/CSR_Commit_Lvl] [get_bd_pins RV32I_ControlUnit_Ve_0/LIC_IP_Lvl]
connect_bd_net [get_bd_pins RV32_Local_Interrupt_0/New_IP] [get_bd_pins RV32I_ControlUnit_Ve_0/LIC_New_IP]
connect_bd_net [get_bd_pins RV32_Local_Interrupt_0/mcause] \
  [get_bd_pins RV32_CSR_Verilog_RTL_0/mcause_i] [get_bd_pins RV32I_ControlUnit_Ve_0/LIC_IP_Cause]
connect_bd_net [get_bd_pins RV32_Local_Interrupt_0/mepc] [get_bd_pins RV32_CSR_Verilog_RTL_0/mepc_i]
connect_bd_net [get_bd_pins RV32_Local_Interrupt_0/mip_o] [get_bd_pins RV32_CSR_Verilog_RTL_0/mip_i]
connect_bd_net [get_bd_pins RV32_Local_Interrupt_0/mstatus_o] [get_bd_pins RV32_CSR_Verilog_RTL_0/mstatus_i]
connect_bd_net [get_bd_pins RV32_Local_Interrupt_0/mtval] [get_bd_pins RV32_CSR_Verilog_RTL_0/mtval_i]
connect_bd_net [get_bd_pins RV32_Local_Interrupt_0/scause] [get_bd_pins RV32_CSR_Verilog_RTL_0/scause_i]
connect_bd_net [get_bd_pins RV32_Local_Interrupt_0/sepc] [get_bd_pins RV32_CSR_Verilog_RTL_0/sepc_i]
connect_bd_net [get_bd_pins RV32_Local_Interrupt_0/sip_o] [get_bd_pins RV32_CSR_Verilog_RTL_0/sip_i]
connect_bd_net [get_bd_pins RV32_Local_Interrupt_0/stval] [get_bd_pins RV32_CSR_Verilog_RTL_0/stval_i]
connect_bd_net [get_bd_pins RV32_Local_Interrupt_0/ucause] [get_bd_pins RV32_CSR_Verilog_RTL_0/ucause_i]
connect_bd_net [get_bd_pins RV32_Local_Interrupt_0/uepc] [get_bd_pins RV32_CSR_Verilog_RTL_0/uepc_i]
connect_bd_net [get_bd_pins RV32_Local_Interrupt_0/uip_o] [get_bd_pins RV32_CSR_Verilog_RTL_0/uip_i]
connect_bd_net [get_bd_pins RV32_Local_Interrupt_0/utval] [get_bd_pins RV32_CSR_Verilog_RTL_0/utval_i]
connect_bd_net [get_bd_pins blk_mem_gen_0/douta] [get_bd_pins DCache/bram_douta]
connect_bd_net [get_bd_pins blk_mem_gen_0/doutb] [get_bd_pins DCache/bram_doutb]
connect_bd_net [get_bd_pins blk_mem_gen_1/douta] [get_bd_pins ICache/bram_douta]
connect_bd_net [get_bd_pins blk_mem_gen_1/doutb] [get_bd_pins ICache/bram_doutb]
connect_bd_net [get_bd_pins processing_system7_0/FCLK_CLK0] \
  [get_bd_pins axi_gpio_0/s_axi_aclk] [get_bd_pins rst_ps7_0_100M/slowest_sync_clk] [get_bd_pins axi_uartlite_0/s_axi_aclk] \
  [get_bd_pins RV32_AXI_Timer_Count_0/s00_axi_aclk] [get_bd_pins RV32_Local_Interrupt_0/clk] \
  [get_bd_pins axi_bram_ctrl_0/s_axi_aclk] [get_bd_pins axi_interconnect_0/ACLK] [get_bd_pins axi_interconnect_0/S00_ACLK] \
  [get_bd_pins axi_interconnect_0/M00_ACLK] [get_bd_pins axi_interconnect_0/M01_ACLK] \
  [get_bd_pins axi_interconnect_0/M02_ACLK] [get_bd_pins axi_interconnect_0/M03_ACLK] \
  [get_bd_pins RV32_CSR_Verilog_RTL_0/clk] [get_bd_pins RV32I_ControlUnit_Ve_0/clk] \
  [get_bd_pins processing_system7_0/M_AXI_GP0_ACLK] [get_bd_pins ps7_0_axi_periph/S00_ACLK] \
  [get_bd_pins axi_gpio_1/s_axi_aclk] [get_bd_pins ps7_0_axi_periph/M00_ACLK] [get_bd_pins ps7_0_axi_periph/ACLK] \
  [get_bd_pins RISCV32I_EXBranch_Da_0/clock] [get_bd_pins DCache/clk] [get_bd_pins ICache/clk] \
  [get_bd_pins RV32I_Memory_Interfa_0/m00_axi_aclk] [get_bd_pins Cache_Controller/clk] [get_bd_pins Cache_Controller/cpu_clk]
connect_bd_net [get_bd_pins processing_system7_0/FCLK_CLK1] \
  [get_bd_pins blk_mem_gen_0/clkb] [get_bd_pins blk_mem_gen_0/clka] [get_bd_pins blk_mem_gen_1/clka] \
  [get_bd_pins blk_mem_gen_1/clkb] [get_bd_pins blk_mem_gen_2/clka] [get_bd_pins blk_mem_gen_2/clkb]
connect_bd_net [get_bd_pins processing_system7_0/FCLK_RESET0_N] [get_bd_pins rst_ps7_0_100M/ext_reset_in]
connect_bd_net [get_bd_pins rst_ps7_0_100M/peripheral_aresetn] \
  [get_bd_pins axi_gpio_0/s_axi_aresetn] [get_bd_pins axi_uartlite_0/s_axi_aresetn] \
  [get_bd_pins RV32_AXI_Timer_Count_0/s00_axi_aresetn] [get_bd_pins RV32_Local_Interrupt_0/resetn] \
  [get_bd_pins axi_bram_ctrl_0/s_axi_aresetn] [get_bd_pins axi_interconnect_0/M02_ARESETN] \
  [get_bd_pins axi_interconnect_0/M03_ARESETN] [get_bd_pins axi_interconnect_0/M01_ARESETN] \
  [get_bd_pins axi_interconnect_0/M00_ARESETN] [get_bd_pins axi_interconnect_0/S00_ARESETN] \
  [get_bd_pins axi_interconnect_0/ARESETN] [get_bd_pins RV32_CSR_Verilog_RTL_0/resetn] \
  [get_bd_pins RV32I_ControlUnit_Ve_0/resetn] [get_bd_pins ps7_0_axi_periph/S00_ARESETN] \
  [get_bd_pins axi_gpio_1/s_axi_aresetn] [get_bd_pins ps7_0_axi_periph/M00_ARESETN] [get_bd_pins ps7_0_axi_periph/ARESETN] \
  [get_bd_pins RISCV32I_EXBranch_Da_0/resetn] [get_bd_pins DCache/resetn] [get_bd_pins ICache/resetn] \
  [get_bd_pins RV32I_Memory_Interfa_0/m00_axi_aresetn] [get_bd_pins Cache_Controller/resetn]
connect_bd_net [get_bd_pins RISCV32I_EXBranch_Da_0/HU_WB_Rd_o] [get_bd_pins RV32I_HazardUnit_Ver_0/WB_Rd]
connect_bd_net [get_bd_pins RISCV32I_EXBranch_Da_0/HU_WB_RegWr] [get_bd_pins RV32I_HazardUnit_Ver_0/WB_RegWr]

# ---- address map ----
assign_bd_address -offset 0x40000000 -range 64K -target_address_space [get_bd_addr_spaces processing_system7_0/Data] [get_bd_addr_segs axi_gpio_1/S_AXI/Reg]
assign_bd_address -offset 0x20000000 -range 256M -target_address_space [get_bd_addr_spaces RV32I_Memory_Interfa_0/M00_AXI] [get_bd_addr_segs axi_bram_ctrl_0/S_AXI/Mem0]
assign_bd_address -offset 0x44A00000 -range 64K -target_address_space [get_bd_addr_spaces RV32I_Memory_Interfa_0/M00_AXI] [get_bd_addr_segs RV32_AXI_Timer_Count_0/S00_AXI/S00_AXI_reg]
assign_bd_address -offset 0x60000000 -range 64K -target_address_space [get_bd_addr_spaces RV32I_Memory_Interfa_0/M00_AXI] [get_bd_addr_segs axi_uartlite_0/S_AXI/Reg]
assign_bd_address -offset 0x60020000 -range 64K -target_address_space [get_bd_addr_spaces RV32I_Memory_Interfa_0/M00_AXI] [get_bd_addr_segs axi_gpio_0/S_AXI/Reg]

validate_bd_design
save_bd_design
